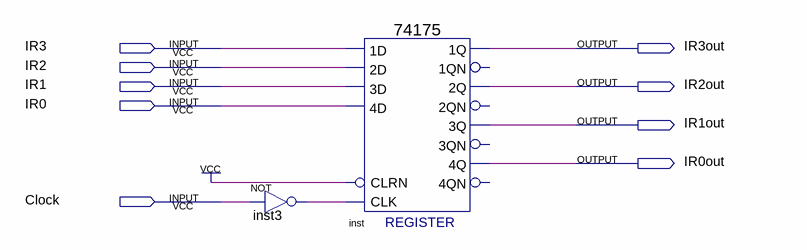
[diagram p0: schematic sheet]
// Quartus schematic Instruction_Register.bdf as structural Verilog: 2 symbols, 9 pins
module Instruction_Register (
  input  IR3,
  input  IR2,
  input  IR1,
  input  IR0,
  input  Clock,
  output IR3out,
  output IR2out,
  output IR1out,
  output IR0out
);

  wire inst3_out;

  not inst3 (inst3_out, Clock);
  \74175  inst (
    .CLRN(1'b1), .CLK(inst3_out), .\3D (IR1), .\2D (IR2), .\1D (IR3), .\4D (IR0), .\1Q (IR3out),
    .\3Q (IR1out), .\2Q (IR2out), .\4Q (IR0out));  // open: 1QN, 2QN, 4QN, 3QN
endmodule
